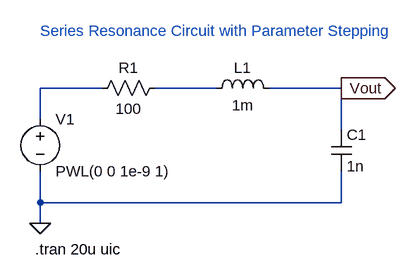
[diagram p0: schematic RLC_1.asc]
RLC_1.asc, the LTspice schematic file:
Version 4.1
SHEET 1 880 680
WIRE 160 64 64 64
WIRE 336 64 240 64
WIRE 528 64 416 64
WIRE 64 112 64 64
WIRE 528 128 528 64
WIRE 64 240 64 192
WIRE 528 240 528 192
WIRE 528 240 64 240
WIRE 64 272 64 240
FLAG 64 272 0
FLAG 528 64 Vout
IOPIN 528 64 Out
SYMBOL res 256 48 R90
WINDOW 0 0 56 VBottom 2
WINDOW 3 32 56 VTop 2
SYMATTR InstName R1
SYMATTR Value 100
SYMBOL ind 320 80 R270
WINDOW 0 32 56 VTop 2
WINDOW 3 5 56 VBottom 2
SYMATTR InstName L1
SYMATTR Value 1m
SYMBOL cap 512 128 R0
SYMATTR InstName C1
SYMATTR Value 1n
SYMBOL voltage 64 96 R0
WINDOW 123 0 0 Left 0
WINDOW 39 0 0 Left 0
SYMATTR InstName V1
SYMATTR Value PWL(0 0 1e-9 1)
TEXT 56 312 Left 2 !.tran 20u uic
TEXT 64 -24 Left 2 ;Series Resonance Circuit with Parameter Stepping

The netlist it stands for:
* RLC_1.asc
R1 N002 N001 100
L1 N002 Vout 1m
C1 Vout 0 1n
V1 N001 0 PWL(0 0 1e-9 1)
.tran 20u uic
* Series Resonance Circuit with Parameter Stepping
.backanno
.end